# Altium schematic sheet eps-obc.SchDoc: EPS-OBC Interface
size A4; DocumentNumber: 1; SheetNumber: 1; SheetTotal: 8
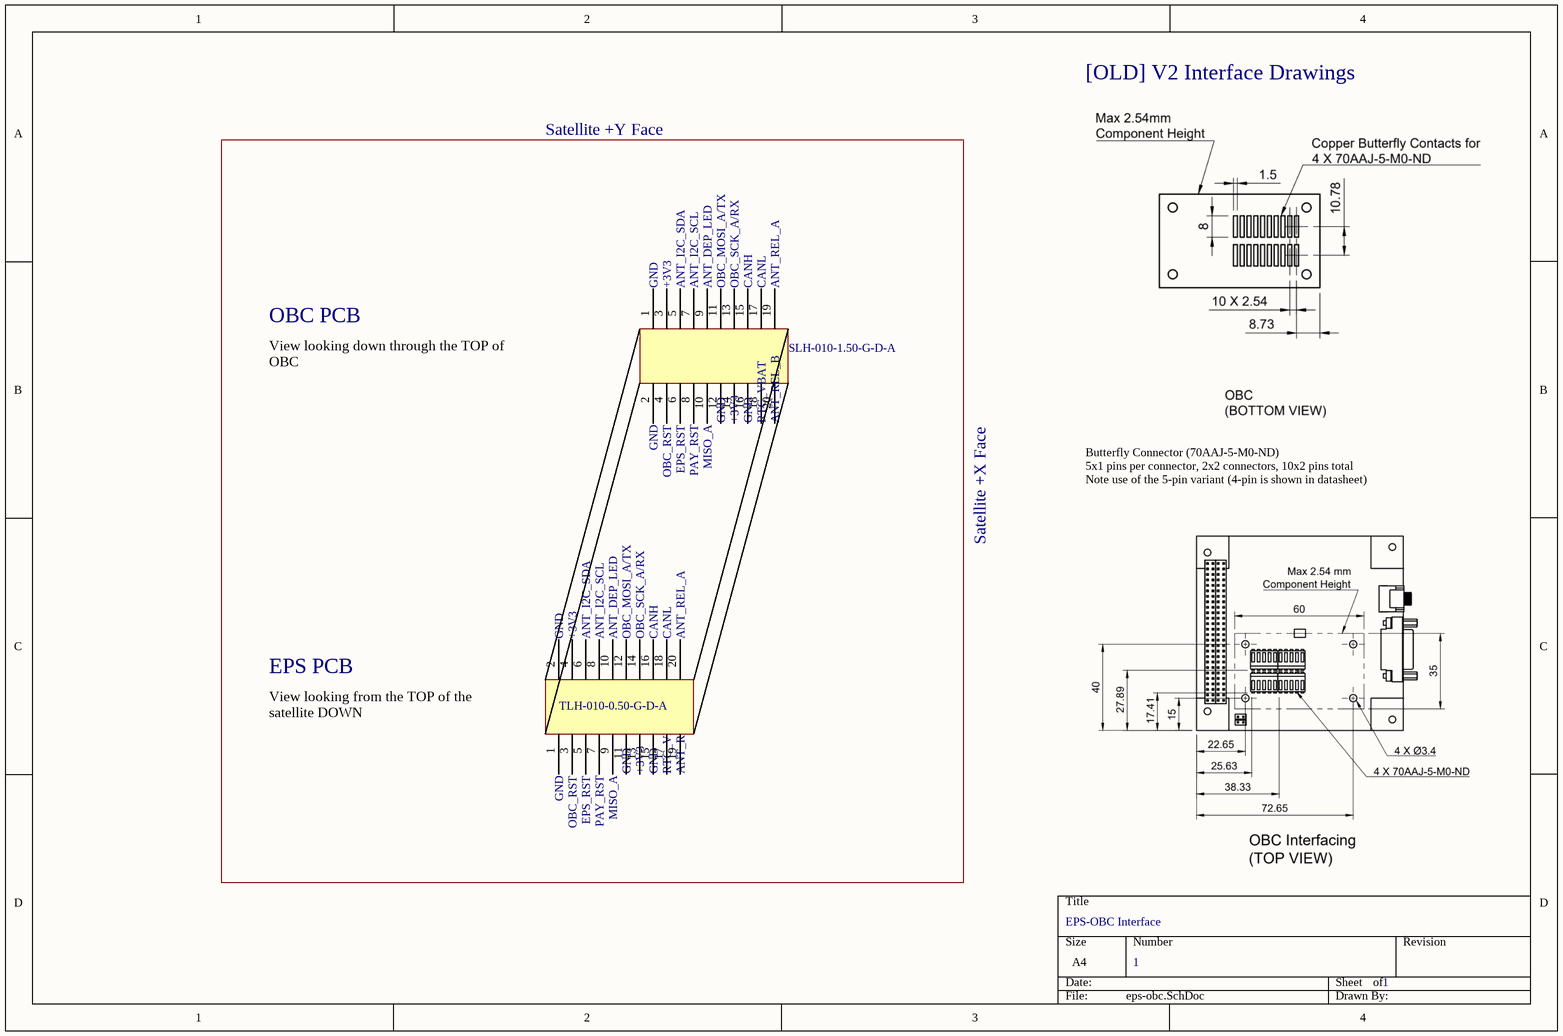
[diagram p0: eps-obc.SchDoc]

## Parts
(Parts that share a designator on the sheet are numbered #1, #2 ... from top to bottom, then left to right.)
J?#1  SLH-010-1.50-G-D-A  [SLH-010-1.50-G-D-A]
J?#2  TLH-010-0.50-G-D-A  [TLH-010-0.50-G-D-A]

## Nets

Not connected (* = marked no-connect by the designer): J?#1 1 2 3 4 5 6 7 8 9 10 11 12 13 14 15 16 17 18 19 20; J?#2 1 2 3 4 5 6 7 8 9 10 11 12 13 14 15 16 17 18 19 20

## Notes on the sheet
- [OLD] V2 Interface Drawings
- Satellite +Y Face
- (near J?#1) GND
- (near J?#1) +3V3
- (near J?#1) ANT_I2C_SDA
- (near J?#1) ANT_I2C_SCL
- (near J?#1) ANT_DEP_LED
- (near J?#1) OBC_MOSI_A/TX
- (near J?#1) OBC_SCK_A/RX
- (near J?#1) CANH
- (near J?#1) CANL
- (near J?#1) ANT_REL_A
- View looking down through the TOP of OBC
- OBC PCB
- (near J?#1) OBC_RST
- (near J?#1) EPS_RST
- (near J?#1) PAY_RST
- (near J?#1) MISO_A
- (near J?#1) RTC_VBAT
- (near J?#1) ANT_REL_B
- Butterfly Connector (70AAJ-5-M0-ND)
  5x1 pins per connector, 2x2 connectors, 10x2 pins total
  Note use of the 5-pin variant (4-pin is shown in datasheet)
- Satellite +X Face
- (near J?#2) GND
- (near J?#2) +3V3
- (near J?#2) ANT_I2C_SDA
- (near J?#2) ANT_I2C_SCL
- (near J?#2) ANT_DEP_LED
- (near J?#2) OBC_MOSI_A/TX
- (near J?#2) OBC_SCK_A/RX
- (near J?#2) CANH
- (near J?#2) CANL
- (near J?#2) ANT_REL_A
- EPS PCB
- (near J?#2) View looking from the TOP of the satellite DOWN
- (near J?#2) OBC_RST
- (near J?#2) EPS_RST
- (near J?#2) PAY_RST
- (near J?#2) MISO_A
- (near J?#2) RTC_VBAT
- (near J?#2) ANT_REL_B

## Library data of the parts
J?#1 = SLH-010-1.50-G-D-A: 0.50 mm Razor Beam™ LP Ultra Low Profile Socket Strip, alignment pin option; Supplier 1: SLH-010-1.50-G-D-A; Supplier Part Number 1: Samtec; ComponentLink1Description: Product Page; ComponentLink1URL: https://www.samtec.com/products/slh-010-1.50-g-d-a
J?#2 = TLH-010-0.50-G-D-A: 0.50 mm Razor Beam LP Ultra Low Profile Terminal Strip, alignment pin option; Supplier 1: Samtec; ComponentLink1Description: Product Page; ComponentLink1URL: https://www.samtec.com/products/tlh-010-0.50-g-d-a; Supplier Part Number 1: TLH-010-0.50-G-D-A